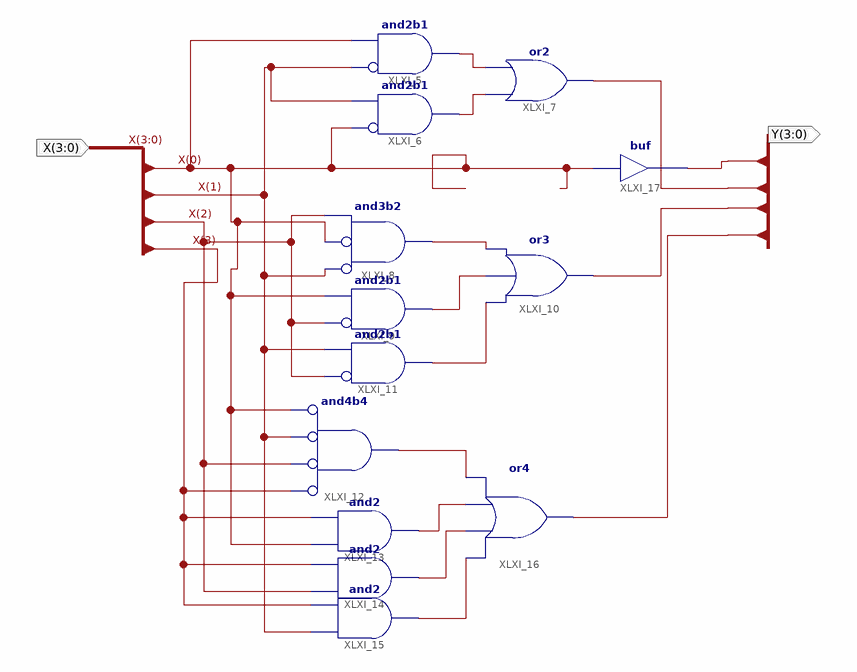
[diagram p0: schematic sheet 1]
// Xilinx ISE schematic schemat1.sch (xc9500xl) as structural Verilog: 13 symbols, 2 ports
module schemat1 (
  input  [3:0] X,
  output [3:0] Y
);

  wire XLXN_8, XLXN_9, XLXN_13, XLXN_14, XLXN_15, XLXN_20, XLXN_21, XLXN_22, XLXN_23;

  and XLXI_5 (XLXN_8, ~X[1], X[0]);  // and2b1
  and XLXI_6 (XLXN_9, ~X[0], X[1]);  // and2b1
  or XLXI_7 (Y[1], XLXN_9, XLXN_8);
  and XLXI_8 (XLXN_13, ~X[1], ~X[0], X[2]);  // and3b2
  and XLXI_9 (XLXN_14, ~X[2], X[0]);  // and2b1
  or XLXI_10 (Y[2], XLXN_15, XLXN_14, XLXN_13);
  and XLXI_11 (XLXN_15, ~X[2], X[1]);  // and2b1
  and XLXI_12 (XLXN_20, ~X[3], ~X[2], ~X[1], ~X[0]);  // and4b4
  and XLXI_13 (XLXN_21, X[0], X[3]);
  and XLXI_14 (XLXN_22, X[2], X[3]);
  and XLXI_15 (XLXN_23, X[1], X[3]);
  or XLXI_16 (Y[3], XLXN_23, XLXN_22, XLXN_21, XLXN_20);
  buf XLXI_17 (Y[0], X[0]);
endmodule
